# Altium schematic sheet TopLevel.SchDoc: Screen Board
size A3; SheetNumber: 1; SheetTotal: 1; SheetTitle: Screen Board
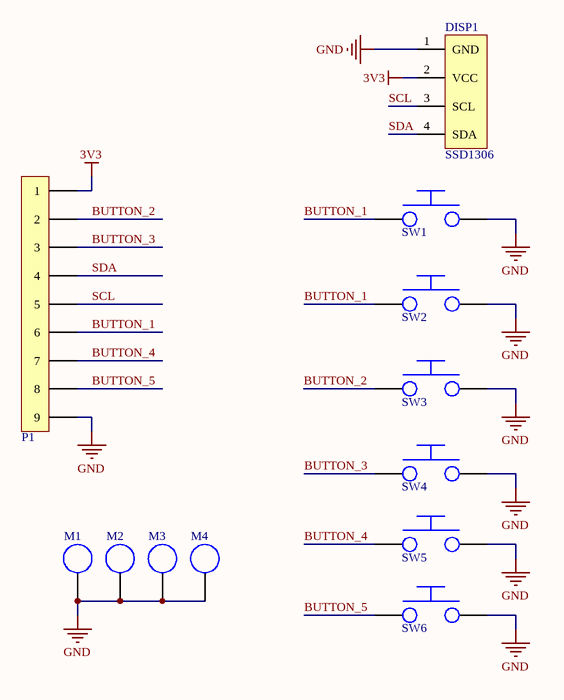
[diagram p0: TopLevel.SchDoc]

## Parts
DISP1  SSD1306  [SSD1306_1.3]
M1  M3 Flat Screw  [M3 Screw]  (value not drawn)
M2  M3 Flat Screw  [M3 Screw]  (value not drawn)
M3  M3 Flat Screw  [M3 Screw]  (value not drawn)
M4  M3 Flat Screw  [M3 Screw]  (value not drawn)
P1  9 Header  [9 Header]  (value not drawn)
SW1  Momentary Button  [TD-19XA]  (value not drawn)
SW2  Momentary Button  [TS1127]  (value not drawn)
SW3  Momentary Button  [Tactile Button 6*6*5mm]  (value not drawn)
SW4  Momentary Button  [Tactile Button 6*6*5mm]  (value not drawn)
SW5  Momentary Button  [Tactile Button 6*6*5mm]  (value not drawn)
SW6  Momentary Button  [Tactile Button 6*6*5mm]  (value not drawn)

## Nets
3V3: DISP1.2(VCC) P1.1
GND: DISP1.1(GND) M1.1 M2.1 M3.1 M4.1 P1.9 SW1.2 SW2.2 SW3.2 SW4.2 SW5.2 SW6.2
BUTTON_1: P1.6 SW1.1 SW2.1
BUTTON_2: P1.2 SW3.1
BUTTON_3: P1.3 SW4.1
BUTTON_4: P1.7 SW5.1
BUTTON_5: P1.8 SW6.1
SCL: DISP1.3(SCL) P1.5
SDA: DISP1.4(SDA) P1.4

## Notes on the sheet
- Size:
- A3
- Variant:
- Revision:
- Drawn By:
- File:
- Date:
- Time:
- Sheet
- of
- AW Audio

## Library data of the parts
DISP1 = SSD1306_1.3: SSD1306 128*64 1.3Inch I2C OLED Module